# Altium schematic sheet Sheet4.SchDoc
size A
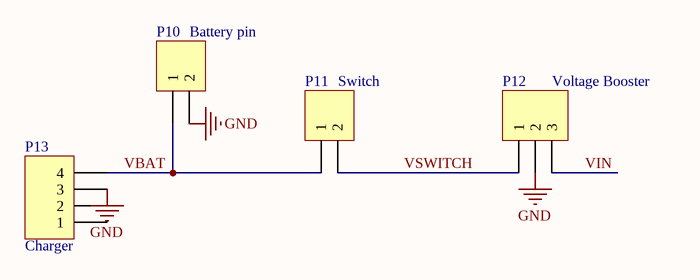
[diagram p0: Sheet4.SchDoc]

## Parts
P10  Battery pin  [HDR1X2]
P11  Switch  [HDR1X2]
P12  Voltage Booster  [Voltage Regulator]
P13  Charger  [HDR1X4]

## Nets
GND: P10.2 P12.2 P13.3
VBAT: P10.1 P11.1 P13.4
VIN: P12.3
VSWITCH: P11.2 P12.1

Not connected (* = marked no-connect by the designer): P13 1 2

## Library data of the parts
P10 P11 = Header 2: Header, 2-Pin; LatestRevisionDate: 17-Jul-2002; LatestRevisionNote: Re-released for DXP Platform.; Publisher: Altium Limited
P12 = Header 3: Header, 3-Pin; LatestRevisionDate: 17-Jul-2002; LatestRevisionNote: Re-released for DXP Platform.; Publisher: Altium Limited
P13 = Header 4: Header, 4-Pin; LatestRevisionDate: 17-Jul-2002; LatestRevisionNote: Re-released for DXP Platform.; Publisher: Altium Limited